# EAGLE schematic power_dist (EAGLE 9.6.0)
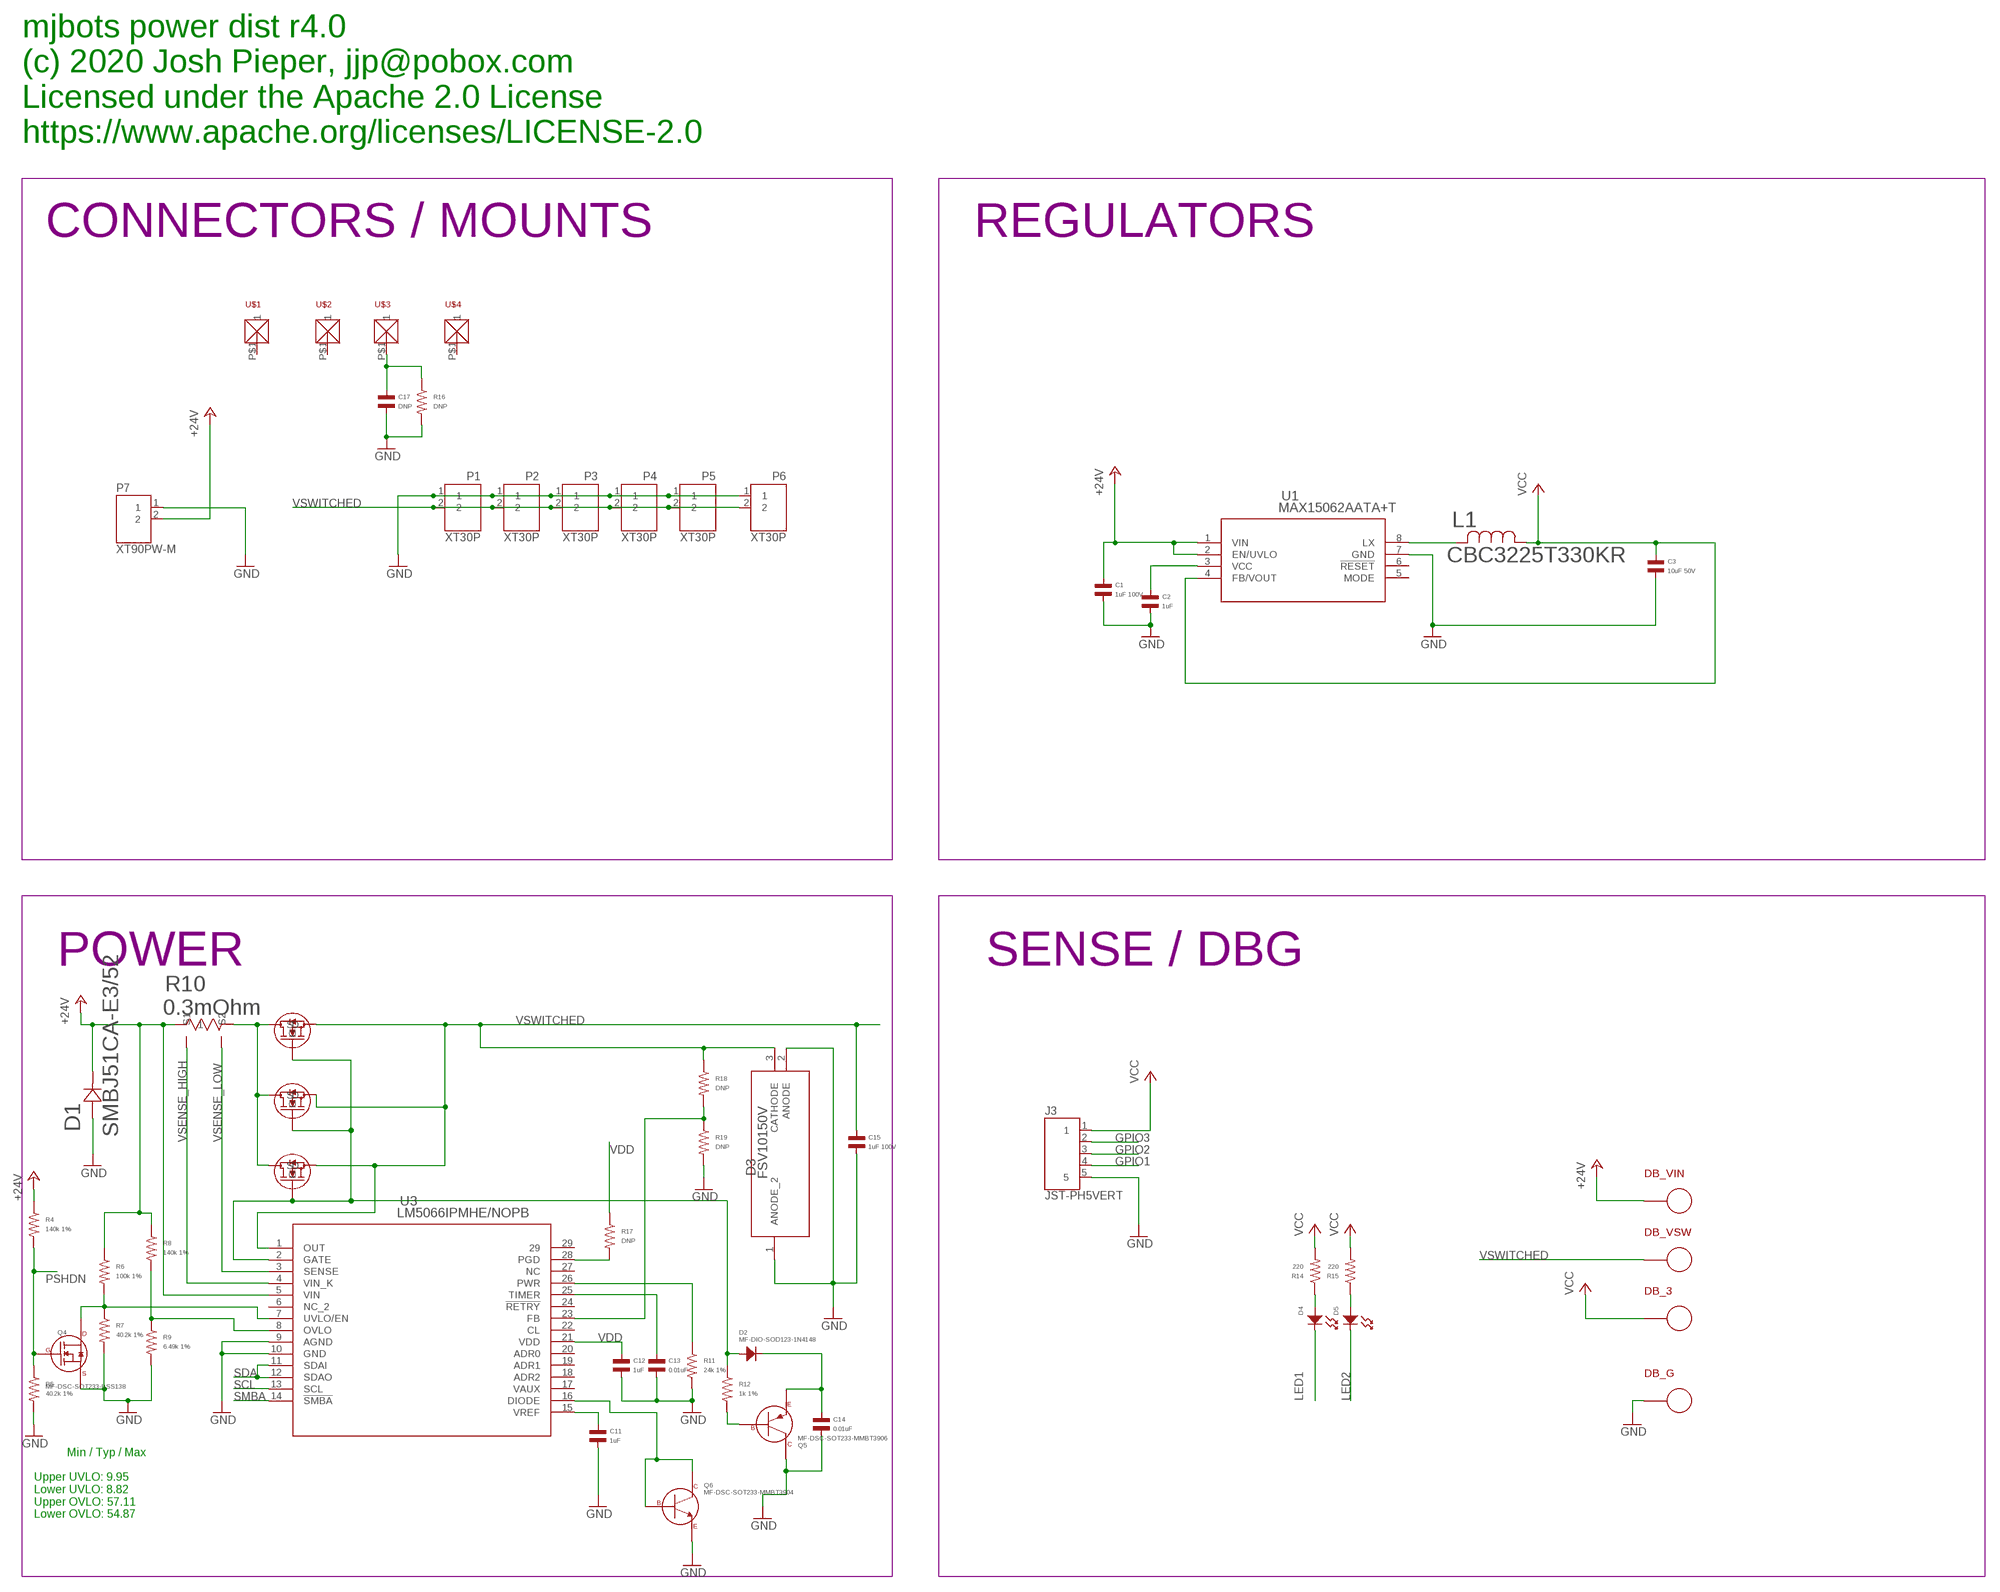
[diagram p0: schematic, sheet 1, part 1 of 2]
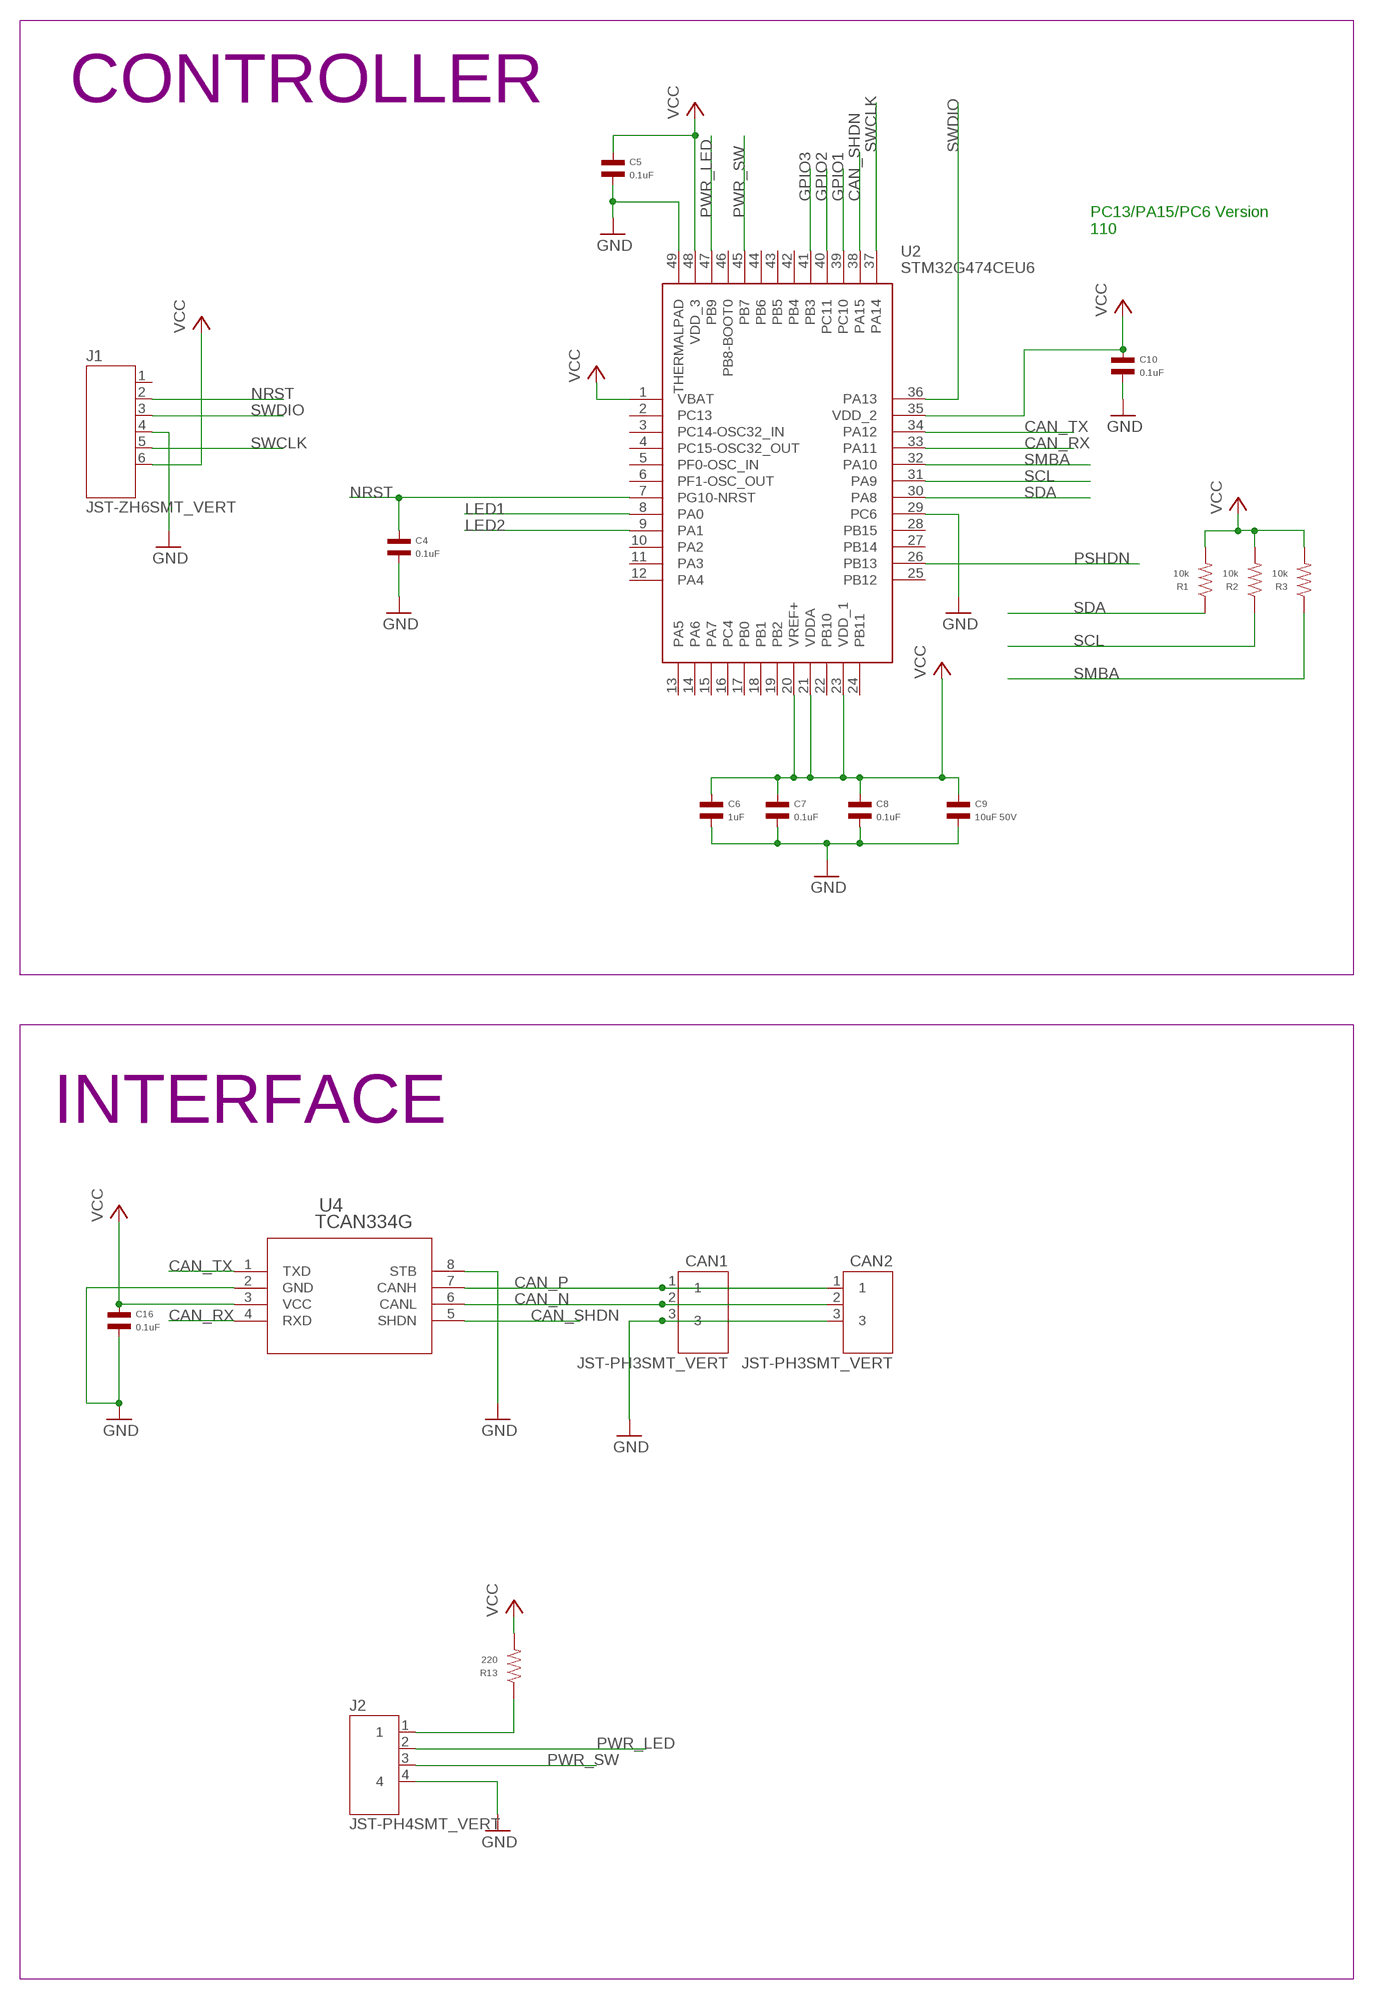
[diagram p1: schematic, sheet 1, part 2 of 2]

## Parts
C1  1uF 100V  CAPACITOR_NP_0805  [C0805]
C2  1uF  CAPACITOR_NP_0603  [C0603]
C3  10uF 50V  CAPACITOR_NP_1206  [C1206]
C4  0.1uF  CAPACITOR_NP_0603  [C0603]
C5  0.1uF  CAPACITOR_NP_0603  [C0603]
C6  1uF  CAPACITOR_NP_0603  [C0603]
C7  0.1uF  CAPACITOR_NP_0603  [C0603]
C8  0.1uF  CAPACITOR_NP_0603  [C0603]
C9  10uF 50V  CAPACITOR_NP_1206  [C1206]
C10  0.1uF  CAPACITOR_NP_0603  [C0603]
C11  1uF  CAPACITOR_NP_0603  [C0603]
C12  1uF  CAPACITOR_NP_0603  [C0603]
C13  0.01uF  CAPACITOR_NP_0603  [C0603]
C14  0.01uF  CAPACITOR_NP_0603  [C0603]
C15  1uF 100V  CAPACITOR_NP_0805  [C0805]
C16  0.1uF  CAPACITOR_NP_0603  [C0603]
C17  DNP  CAPACITOR_NP_0603  [C0603]
CAN1  JST-PH3SMT_VERT  [JST_B3B_PH-SM4-TB(LF)(SN)]
CAN2  JST-PH3SMT_VERT  [JST_B3B_PH-SM4-TB(LF)(SN)]
D1  SMBJ51CA-E3/52  [DIODE_DO-214AC]
D2  MF-DIO-SOD123-1N4148  DIODES_1N4148_SOD-123  [SOD-123]
D3  FSV10150V  [TO277-3L_ONS]
D4  LED_SINGLE-0603  [LED0603]
D5  LED_SINGLE-0603  [LED0603]
DB_3  PAD24AWG_PAD  [24AWG_PAD]
DB_G  PAD24AWG_PAD  [24AWG_PAD]
DB_VIN  PAD24AWG_PAD  [24AWG_PAD]
DB_VSW  PAD24AWG_PAD  [24AWG_PAD]
J1  JST-ZH6SMT_VERT  [JST_B6B-ZR-SM4-TF(LF)(SN)]
J2  JST-PH4SMT_VERT  [JST_B4B_PH-SM4-TB(LF)(SN)]
J3  JST-PH5VERT  [JST_B5B_PH-SM4-TB(LF)(SN)]
L1  CBC3225T330KR  [IND_TAIYO_CBC3225_TAY]
P1  XT30P  [XT30P]
P2  XT30P  [XT30P]
P3  XT30P  [XT30P]
P4  XT30P  [XT30P]
P5  XT30P  [XT30P]
P6  XT30P  [XT30P]
P7  XT90PW-M  [XT90PW-M]
Q1  PSMN4R8-100BSEJ  [D2PAK_SOT404_NEX]
Q2  PSMN4R8-100BSEJ  [D2PAK_SOT404_NEX]
Q3  PSMN4R8-100BSEJ  [D2PAK_SOT404_NEX]
Q4  MF-DSC-SOT233-BSS138  N-CHANNEL_FET_BSS138_SOT-23-3  [SOT-23-3]
Q5  MF-DSC-SOT233-MMBT3906  PNP_BJT_MMBT3906_SOT-23-3  [SOT-23-3]
Q6  MF-DSC-SOT233-MMBT3904  NPN_BJTMMBT3904_SOT-23-3  [SOT-23-3]
R1  10k  RESISTOR_0603  [R0603]
R2  10k  RESISTOR_0603  [R0603]
R3  10k  RESISTOR_0603  [R0603]
R4  140k 1%  RESISTOR_0603  [R0603]
R5  40.2k 1%  RESISTOR_0603  [R0603]
R6  100k 1%  RESISTOR_0603  [R0603]
R7  40.2k 1%  RESISTOR_0603  [R0603]
R8  140k 1%  RESISTOR_0603  [R0603]
R9  6.49k 1%  RESISTOR_0603  [R0603]
R10  0.3mOhm  SENSE_RESISTOR2512  [SHUNT2512]
R11  24k 1%  RESISTOR_0603  [R0603]
R12  1k 1%  RESISTOR_0603  [R0603]
R13  220  RESISTOR_0603  [R0603]
R14  220  RESISTOR_0603  [R0603]
R15  220  RESISTOR_0603  [R0603]
R16  DNP  RESISTOR_0603  [R0603]
R17  DNP  RESISTOR_0603  [R0603]
R18  DNP  RESISTOR_0603  [R0603]
R19  DNP  RESISTOR_0603  [R0603]
U1  MAX15062AATA+T  [21-0487A_MXM]
U2  STM32G474CEU6  [QFN50P700X700X60-49N]
U3  LM5066IPMHE/NOPB  [MXA28A_TEX]
U4  TCAN334G  [SOIC8]
U$1  MOUNT  [M2.5MOUNT]
U$2  MOUNT  [M2.5MOUNT]
U$3  MOUNT  [M2.5MOUNT]
U$4  MOUNT  [M2.5MOUNT]

## Nets
+24V: C1.P$1 D1.1 DB_VIN.P$1 P7.2 R4.P$1 R6.P$1 R8.P$1 R10.1 U1.1(VIN) U1.2(EN/UVLO) U3.5(VIN)
CAN_N: CAN1.2 CAN2.2 U4.6(CANL)
CAN_P: CAN1.1 CAN2.1 U4.7(CANH)
CAN_RX: U2.33(PA11) U4.4(RXD)
CAN_SHDN: U2.38(PA15) U4.5(SHDN)
CAN_TX: U2.34(PA12) U4.1(TXD)
GND: C1.P$2 C2.P$2 C3.P$2 C4.P$2 C5.P$2 C6.P$2 C7.P$2 C8.P$2 C9.P$2 C10.P$2 C11.P$2 C12.P$2 C13.P$2 C14.P$2 C15.P$2 C16.P$2 C17.P$2 CAN1.3 CAN2.3 D1.2 D3.1(ANODE_2) D3.2(ANODE) DB_G.P$1 J1.4 J2.4 J3.5 P1.1 P2.1 P3.1 P4.1 P5.1 P6.1 P7.1 Q4.P$2(SOURCE) Q5.P$3(COLLECTOR) Q6.P$2(EMITTER) R5.P$2 R7.P$2 R9.P$2 R11.P$2 R16.P$2 R19.P$2 U1.7(GND) U2.29(PC6) U2.49(THERMALPAD) U3.9(AGND) U3.10(GND) U4.2(GND) U4.8(STB)
GPIO1: J3.4 U2.39(PC10)
GPIO2: J3.3 U2.40(PC11)
GPIO3: J3.2 U2.41(PB3)
LED1: D4.CATHODE U2.8(PA0)
LED2: D5.CATHODE U2.9(PA1)
N$1: L1.2 U1.8(LX)
N$2: J2.1 R13.P$1
N$3: Q6.P$1(BASE) Q6.P$3(COLLECTOR) U3.16(DIODE)
N$4: C2.P$1 U1.3(VCC)
N$5: D2.ANODE Q1.1(G) Q2.1(G) Q3.1(G) R12.P$1 U3.2(GATE)
N$6: R18.P$2 R19.P$1 U3.23(FB)
N$7: C11.P$1 U3.15(VREF)
N$8: D4.ANODE R14.P$1
N$9: Q4.P$3(DRAIN) R6.P$2 R7.P$1 U3.7(UVLO/EN)
N$10: R11.P$1 U3.26(PWR)
N$11: C13.P$1 U3.25(TIMER)
N$12: R17.P$2 U3.28(PGD)
N$13: C14.P$1 D2.CATHODE Q5.P$2(EMITTER)
N$14: D5.ANODE R15.P$1
N$15: C17.P$1 R16.P$1 U$3.P$1
N$16: Q5.P$1(BASE) R12.P$2
NRST: C4.P$1 J1.2 U2.7(PG10-NRST)
PSHDN: Q4.P$1(GATE) R4.P$2 R5.P$1 U2.26(PB13)
PWR_LED: J2.2 U2.47(PB9)
PWR_SW: J2.3 U2.45(PB7)
SCL: R2.P$1 U2.31(PA9) U3.13(SCL)
SDA: R1.P$1 U2.30(PA8) U3.11(SDAI) U3.12(SDAO)
SMBA: R3.P$1 U2.32(PA10) U3.14(!SMBA)
SWCLK: J1.5 U2.37(PA14)
SWDIO: J1.3 U2.36(PA13)
VCC [power]: C3.P$1 C5.P$1 C6.P$1 C7.P$1 C8.P$1 C9.P$1 C10.P$1 C16.P$1 DB_3.P$1 J1.6 J3.1 L1.1 R1.P$2 R2.P$2 R3.P$2 R13.P$2 R14.P$2 R15.P$2 U1.4(FB/VOUT) U2.1(VBAT) U2.20(VREF+) U2.21(VDDA) U2.23(VDD_1) U2.35(VDD_2) U2.48(VDD_3) U4.3(VCC)
VDD: C12.P$1 R17.P$1 U3.21(VDD)
VIN_POST: Q1.2(D) Q2.2(D) Q3.2(D) R10.2
VIN_SENSE: R8.P$2 R9.P$1 U3.8(OVLO)
VSENSE_HIGH: R10.3(S1) U3.4(VIN_K)
VSENSE_LOW: R10.4(S2) U3.3(SENSE)
VSWITCHED: C15.P$1 D3.3(CATHODE) DB_VSW.P$1 P1.2 P2.2 P3.2 P4.2 P5.2 P6.2 Q1.3(S) Q2.3(S) Q3.3(S) R18.P$1 U3.1(OUT)
Unconnected: J1.1 U1.5(MODE) U1.6(!RESET) U2.2(PC13) U2.3(PC14-OSC32_IN) U2.4(PC15-OSC32_OUT) U2.5(PF0-OSC_IN) U2.6(PF1-OSC_OUT) U2.10(PA2) U2.11(PA3) U2.12(PA4) U2.13(PA5) U2.14(PA6) U2.15(PA7) U2.16(PC4) U2.17(PB0) U2.18(PB1) U2.19(PB2) U2.22(PB10) U2.24(PB11) U2.25(PB12) U2.27(PB14) U2.28(PB15) U2.42(PB4) U2.43(PB5) U2.44(PB6) U2.46(PB8-BOOT0) U3.6(NC_2) U3.17(VAUX) U3.18(ADR2) U3.19(ADR1) U3.20(ADR0) U3.22(CL) U3.24(!RETRY) U3.27(NC) U3.29 U$1.P$1 U$2.P$1 U$4.P$1

## Notes on the sheet
- mjbots power dist r4.0
  (c) 2020 Josh Pieper, jjp@pobox.com
  Licensed under the Apache 2.0 License
  https://www.apache.org/licenses/LICENSE-2.0
- CONNECTORS / MOUNTS | REGULATORS | CONTROLLER
- PC13/PA15/PC6 Version
  110
- POWER | SENSE / DBG | INTERFACE
- Min / Typ / Max
  
  Upper UVLO: 9.95
  Lower UVLO: 8.82
  Upper OVLO: 57.11
  Lower OVLO: 54.87

## Library data of the parts
C1 C15 = mfpassives:CAPACITOR_NP: Library: MF_Passives Description: Device for Non-Polarized Capacitors. Manufacture part number (MPN) can be added via Attributes. Check https://factory.macrofab.com/parts for the house parts list.; MF: MURATA; MPN: GCM21BC72A105KE36L; POPULATE: 1
C2 C6 C11 C12 = mfpassives:CAPACITOR_NP: Library: MF_Passives Description: Device for Non-Polarized Capacitors. Manufacture part number (MPN) can be added via Attributes. Check https://factory.macrofab.com/parts for the house parts list.; HOUSEPART: 1; MPN: MF-CAP-0603-1uF; POPULATE: 1
C3 C9 = mfpassives:CAPACITOR_NP: Library: MF_Passives Description: Device for Non-Polarized Capacitors. Manufacture part number (MPN) can be added via Attributes. Check https://factory.macrofab.com/parts for the house parts list.; MF: TDK; MPN: C3216X7R1H106K160AE; POPULATE: 1
C4 C5 C7 C8 C10 C16 = mfpassives:CAPACITOR_NP: Library: MF_Passives Description: Device for Non-Polarized Capacitors. Manufacture part number (MPN) can be added via Attributes. Check https://factory.macrofab.com/parts for the house parts list.; HOUSEPART: 1; MPN: MF-CAP-0603-0.1uF; POPULATE: 1
C13 C14 = mfpassives:CAPACITOR_NP: Library: MF_Passives Description: Device for Non-Polarized Capacitors. Manufacture part number (MPN) can be added via Attributes. Check https://factory.macrofab.com/parts for the house parts list.; HOUSEPART: 1; MPN: MF-CAP-0603-0.01uF; POPULATE: 1
C17 = mfpassives:CAPACITOR_NP: Library: MF_Passives Description: Device for Non-Polarized Capacitors. Manufacture part number (MPN) can be added via Attributes. Check https://factory.macrofab.com/parts for the house parts list.; POPULATE: 0
CAN1 CAN2 = precharge:JST-PH3; MF: JST; MPN: B3B-PH-SM4-TB(LF)(SN); POPULATE: 1
D1 = power_dist:SMBJ51CA-E3/52; BUILT_BY: EMA_UL_Team; MANUFACTURER_PART_NUMBER: SMBJ51CA-E3/52; MPN: SMBJ51CA-E3/52; POPULATE: 1; VENDOR: Vishay
D2 = mfdiscretesemi:DIODES: Library: MF_Discrete_Semiconductor Description: Device for Single Packaged Diodes.; HOUSEPART: 1; MPN: MF-DIO-SOD123-1N4148; POPULATE: 1; URL: https://factory.macrofab.com/part/MF-DIO-SOD123-1N4148
D3 = power_dist:FSV10150V; BUILT_BY: EMA_Jessica; COPYRIGHT: Copyright (C) 2018 Accelerated Designs. All rights reserved; MANUFACTURER_PART_NUMBER: FSV10150V; MPN: FSV10150V; POPULATE: 1; SOURCELIBRARY: ON_Semiconductor_2019-12-30; VENDOR: ON Semiconductor
D4 D5 = mfleds:LED_SINGLE: Library: MF_LEDs Description: Device for Single LED Packages. Manufacture part number (MFG#) can be added via Attributes.; HOUSEPART: 1; MPN: MF-LED-0603-RED; POPULATE: 1
DB_3 DB_G DB_VIN DB_VSW = precharge:PAD; POPULATE: 0
J1 = precharge:JST-ZH6; MF: JST; MPN: B6B-ZR-SM4-TF(LF)(SN); POPULATE: 1
J2 = precharge:JST-PH4; MF: JST; MPN: B4B-PH-SM4-TB(LF)(SN); POPULATE: 1
J3 = power_dist:JST-PH5; MF: JST; MPN: B5B-PH-SM4-TB(LF)(SN); POPULATE: 1
L1 = power_dist:CBC3225T330KR; BUILT_BY: EMA_UL_Team; MANUFACTURER_PART_NUMBER: CBC3225T330KR; MPN: CBC3225T330KR; POPULATE: 1; SOURCELIBRARY: TaiyoYuden_2011-01-01_IND_CB; VENDOR: TAIYO YUDEN
P1-P6 = precharge:XT30; MF: AMASS; MPN: XT30UPB-F; POPULATE: 1
P7 = power_dist:XT90; POPULATE: 0
Q1-Q3 = power_dist:PSMN4R8-100BSEJ; BUILT_BY: EMA_Cory; COPYRIGHT: Copyright (C) 2018 Accelerated Designs. All rights reserved; DATASHEET: https://assets.nexperia.com/documents/data-sheet/PSMN4R8-100BSE.pdf; MANUFACTURER_PART_NUMBER: PSMN4R8-100BSEJ; MPN: PSMN4R8-100BSEJ; POPULATE: 1; SOURCELIBRARY: Nexperia_2020-02-27; VENDOR: Nexperia
Q4 = mfdiscretesemi:N-CHANNEL_FET: Library: MF_Discrete_Semiconductor Description: Device for Single N-Channel Mosfet. Manufacture part number (MFG#) can be added via Attributes.; HOUSEPART: 1; MPN: MF-DSC-SOT233-BSS138; POPULATE: 1; URL: https://factory.macrofab.com/part/MF-DSC-SOT233-BSS138
Q5 = mfdiscretesemi:PNP_BJT: Library: MF_Discrete_Semiconductor Description: Device for Single PNP BJT Transistors. Manufacture part number (MFG#) can be added via Attributes.; HOUSEPART: 1; MPN: MF-DSC-SOT233-MMBT3906; POPULATE: 1; URL: https://factory.macrofab.com/part/MF-DSC-SOT233-MMBT3906
Q6 = mfdiscretesemi:NPN_BJT: Library: MF_Discrete_Semiconductor Description: Device for Single NPN BJT Transistors. Manufacture part number (MFG#) can be added via Attributes.; HOUSEPART: 1; MPN: MF-DSC-SOT233-MMBT3904; POPULATE: 1; URL: https://factory.macrofab.com/part/MF-DSC-SOT233-MMBT3904
R1-R3 = mfpassives:RESISTOR: Library: MF_Passives Description: Device for Resistors. Manufacture part number (MPN), Voltage, Tolerance, and Wattage Rating can be added via Attributes. Check https://factory.macrofab.com/parts for the house parts list.; HOUSEPART: 1; MPN: MF-RES-0603-10K; POPULATE: 1
R4 R8 = mfpassives:RESISTOR: Library: MF_Passives Description: Device for Resistors. Manufacture part number (MPN), Voltage, Tolerance, and Wattage Rating can be added via Attributes. Check https://factory.macrofab.com/parts for the house parts list.; MF: YAGEO; MPN: RC0603FR-07140KL; POPULATE: 1
R5 R7 = mfpassives:RESISTOR: Library: MF_Passives Description: Device for Resistors. Manufacture part number (MPN), Voltage, Tolerance, and Wattage Rating can be added via Attributes. Check https://factory.macrofab.com/parts for the house parts list.; MF: YAGEO; MPN: RC0603FR-0740K2L; POPULATE: 1
R6 = mfpassives:RESISTOR: Library: MF_Passives Description: Device for Resistors. Manufacture part number (MPN), Voltage, Tolerance, and Wattage Rating can be added via Attributes. Check https://factory.macrofab.com/parts for the house parts list.; MF: YAGEO; MPN: RC0603FR-07100KL; POPULATE: 1
R9 = mfpassives:RESISTOR: Library: MF_Passives Description: Device for Resistors. Manufacture part number (MPN), Voltage, Tolerance, and Wattage Rating can be added via Attributes. Check https://factory.macrofab.com/parts for the house parts list.; MF: YAGEO; MPN: RC0603FR-076K49L; POPULATE: 1
R10 = power_dist:SENSE_RESISTOR; MF: VISHAY DALE; MPN: WSLF2512L3000FEA; POPULATE: 1
R11 = mfpassives:RESISTOR: Library: MF_Passives Description: Device for Resistors. Manufacture part number (MPN), Voltage, Tolerance, and Wattage Rating can be added via Attributes. Check https://factory.macrofab.com/parts for the house parts list.; MF: YAGEO; MPN: RC0603FR-0724KL; POPULATE: 1
R12 = mfpassives:RESISTOR: Library: MF_Passives Description: Device for Resistors. Manufacture part number (MPN), Voltage, Tolerance, and Wattage Rating can be added via Attributes. Check https://factory.macrofab.com/parts for the house parts list.; MF: YAGEO; MPN: RC0603FR-071KL; POPULATE: 1
R13-R15 = mfpassives:RESISTOR: Library: MF_Passives Description: Device for Resistors. Manufacture part number (MPN), Voltage, Tolerance, and Wattage Rating can be added via Attributes. Check https://factory.macrofab.com/parts for the house parts list.; HOUSEPART: 1; MPN: MF-RES-0603-220; POPULATE: 1
R16-R19 = mfpassives:RESISTOR: Library: MF_Passives Description: Device for Resistors. Manufacture part number (MPN), Voltage, Tolerance, and Wattage Rating can be added via Attributes. Check https://factory.macrofab.com/parts for the house parts list.; POPULATE: 0
U1 = power_dist:MAX15062AATA+T; BUILT_BY: EMA_Jessica; COPYRIGHT: Copyright (C) 2018 Accelerated Designs. All rights reserved; MANUFACTURER_PART_NUMBER: MAX15062AATA+T; MPN: MAX15062AATA+T; POPULATE: 1; REVISION: 1; SOURCELIBRARY: Maxim_DP_2018-06-12; VENDOR: Maxim Integrated Products
U2 = precharge:STM32G474CEU6: STMICROELECTRONICS - STM32G474CEU6 - MCU, 32BIT, 170MHZ, UFQFPN-48 Source: Datasheet <https://componentsearchengine.com/Datasheets/1/STM32G474CEU6.pdf>; DESCRIPTION: STMICROELECTRONICS - STM32G474CEU6 - MCU, 32BIT, 170MHZ, UFQFPN-48; HEIGHT: 0.6mm; MANUFACTURER_NAME: STMicroelectronics; MANUFACTURER_PART_NUMBER: STM32G474CEU6; MF: ST; MOUSER_PART_NUMBER: 511-STM32G474CEU6; MOUSER_PRICE-STOCK: https://www.mouser.com/Search/Refine.aspx?Keyword=511-STM32G474CEU6; MPN: STM32G474CEU6; POPULATE: 1
U3 = power_dist:LM5066IPMHE/NOPB; BUILT_BY: EMA_UL_Team; MANUFACTURER: Texas Instruments; MANUFACTURER_PART_NUMBER: LM5066IPMHE/NOPB; MF: TI; MPN: LM5066IPMHE/NOPB; POPULATE: 1; SOURCELIBRARY: TI_2016-05-20; VENDOR: Texas Instruments
U4 = precharge:TCAN334G; MF: Analog; MPN: LTC2875IS8; POPULATE: 1
U$1-U$4 = power_dist:MOUNT; POPULATE: 0

## Net classes
1 power: width 0.254 mm